# EAGLE design rear (EAGLE 9.6.2)
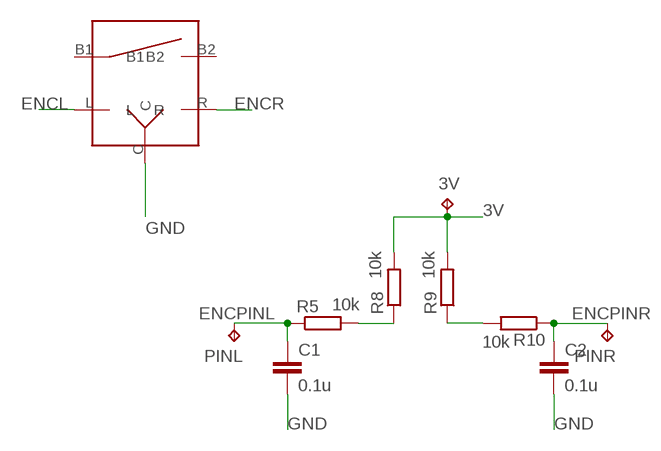
[diagram p0: schematic, sheet 1]

## Parts
3V  TPTP14R  [TP14R]
C1  0.1u  C-EUC0805  [C0805]
C2  0.1u  C-EUC0805  [C0805]
PINL  TPTP14R  [TP14R]
PINR  TPTP14R  [TP14R]
R5  10k  R-EU_M0805  [M0805]
R8  10k  R-EU_M0805  [M0805]
R9  10k  R-EU_M0805  [M0805]
R10  10k  R-EU_M0805  [M0805]
U$1  ENCODER  [ENCODER]

## Nets
3V [battery]: 3V.TP R8.2 R9.2
ENCL: R5.2 R8.1 U$1.L
ENCPINL: C1.1 PINL.TP R5.1
ENCPINR: C2.1 PINR.TP R10.1
ENCR: R9.1 R10.2 U$1.R
GND [battery]: C1.2 C2.2 U$1.C
Unconnected: U$1.B1 U$1.B2

## Library data of the parts
3V PINL PINR = testpad:TP: Test pad
C1 C2 = resistor:C-EU: CAPACITOR, European symbol
R5 R8-R10 = resistor:R-EU_: RESISTOR, European symbol
U$1 = general:ENCODER

## Net classes
0 default: width 0.203 mm
1 battery: width 0.305 mm, clearance 0.152 mm

## Board
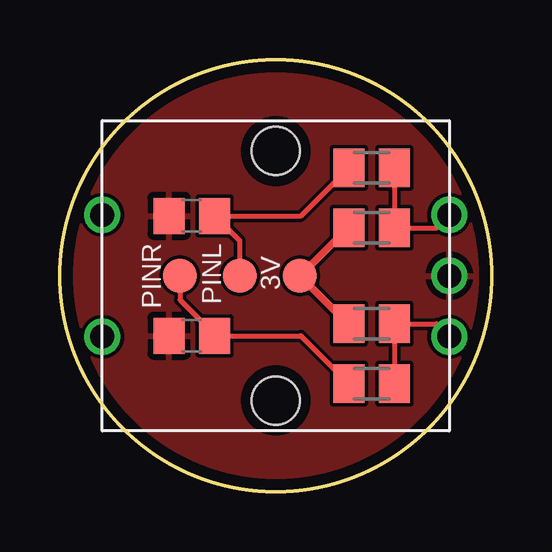
[diagram p1: board, top side]
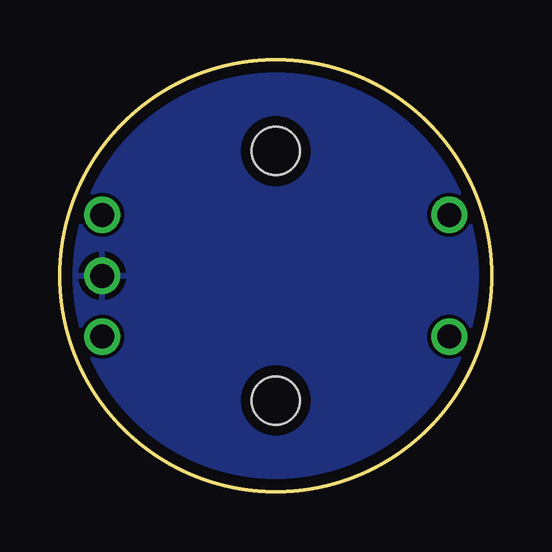
[diagram p2: board, bottom side, seen from below]

Size 18 x 18 mm. Coordinates in mm from the lower left corner, seen from the top.
Outline: circle at 9,9 radius 9
Copper layers (1*16): Top 0.035mm / dielectric 1.5mm / Bottom 0.035mm
Design rules "default *": minimum track width 6mil, minimum drill 0.35mm, track to track 6mil, track to pad 6mil, pad to pad 6mil, via to via 6mil, smd to smd 6mil, copper to edge 18mil, drill to drill 6mil, minimum pad ring 10mil, minimum via ring 8mil, stop-mask expansion 4mil, vias tented up to drill 0mil, thermal gap 10mil

### Footprints (pad centres in the part's own frame; a part is rotated, then mirrored left to right if it is on the bottom)
TP14R = smd 1.4 x 1.4: TP 0,0
C0805 = smd 1.3 x 1.5: 1 -0.95,0; 2 0.95,0
M0805 = smd 1.3 x 1.6: 1 -0.95,0; 2 0.95,0
ENCODER = drill 1: B1 -7.239,2.54; B2 -7.239,-2.54; C 7.239,0; L 7.239,2.54; R 7.239,-2.54 | hole 2: 0,5.207; 0,-5.207

### Placement (x,y rotation side)
3V  10,9 0 top
C1  5.5,11.5 180 top
C2  5.5,6.5 180 top
PINL  7.5,9 0 top
PINR  5,9 0 top
R5  13,13.5 0 top
R8  13,11 180 top
R9  13,7 180 top
R10  13,4.5 0 top
U$1  9,9 0 top

### Tracks (layer width: path | path; a pad name or v marks a point on that pad's centre or on a via)
3V
  Top 0.305: R8.2 12,11 3V.TP 12,7 R9.2
ENCL
  Top 0.203: R5.2 R8.1 15.7,11 U$1.L
ENCPINL
  Top 0.203: R5.1 10.05,11.5 C1.1 7.5,10.45 PINL.TP
ENCPINR
  Top 0.203: C2.1 6.5,6.5 | 6.5,6.5 10.05,6.5 R10.1 | PINR.TP 5,8 6.5,6.5
ENCR
  Top 0.203: R10.2 R9.1 15.7,7 U$1.R
GND
  pour Top: 0,0 0,22.35 22.35,22.35 22.35,0
  pour Bottom: -0.5,-0.5 -0.5,23 23,23 23,-0.5